# Altium schematic sheet transc_MIWI2400.SchDoc
size A; PageSetup: Record=PageOptions|CenterHorizontal=True|CenterVertical=True|PrintScale=1.00|XCorrection=1.00|YCorrection=1.00|PrintKind=1|BorderSize=5000000|LeftOffset=0|BottomOffset=0|Orientation=2|PaperLength=1000|PaperWidth=1000|Scale=100|PaperSource=7|PrintQuality=-4|MediaType=1|DitherType=10|PaperKind=A4|PrintScaleMode=1
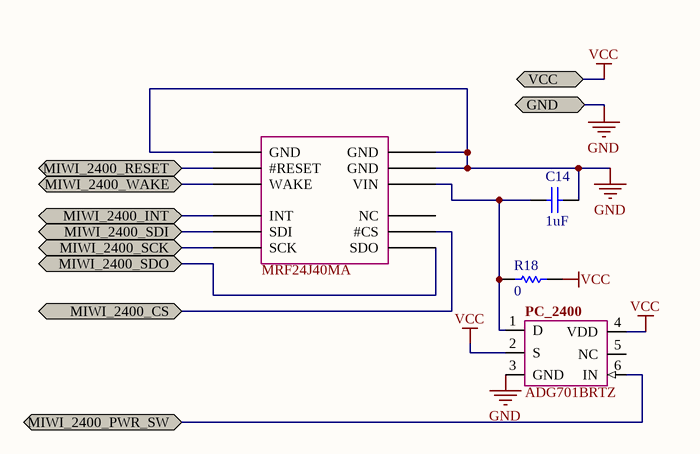
[diagram p0: transc_MIWI2400.SchDoc]

## Parts
C14  value 1uF  [1608[0603]]  (hidden comment: Cap)
MRF24J40MA  MRF24J40MA  [MRF24J40MA]  (value not drawn)
PC_2400  ADG701BRTZ  [SOT23-6_L]
R18  value 0  [1608[0603]]  (hidden comment: resistor)

## Ports
GND, MIWI_2400_CS, MIWI_2400_INT, MIWI_2400_PWR_SW, MIWI_2400_RESET, MIWI_2400_SCK, MIWI_2400_SDI, MIWI_2400_SDO, MIWI_2400_WAKE, VCC

## Nets
GND: C14.1 MRF24J40MA.1(GND) MRF24J40MA.11(GND) MRF24J40MA.12(GND) PC_2400.3(GND) ; port GND
VCC: PC_2400.2(S) PC_2400.4(VDD) R18.1 ; port VCC
MIWI_2400_CS: MRF24J40MA.8(#CS) ; port MIWI_2400_CS
MIWI_2400_INT: MRF24J40MA.4(INT) ; port MIWI_2400_INT
MIWI_2400_PWR_SW: PC_2400.6(IN) ; port MIWI_2400_PWR_SW
MIWI_2400_RESET: MRF24J40MA.2(#RESET) ; port MIWI_2400_RESET
MIWI_2400_SCK: MRF24J40MA.6(SCK) ; port MIWI_2400_SCK
MIWI_2400_SDI: MRF24J40MA.5(SDI) ; port MIWI_2400_SDI
MIWI_2400_SDO: MRF24J40MA.7(SDO) ; port MIWI_2400_SDO
MIWI_2400_WAKE: MRF24J40MA.3(WAKE) ; port MIWI_2400_WAKE
NetC14_2: C14.2 MRF24J40MA.10(VIN) PC_2400.1(D) R18.2

Not connected (* = marked no-connect by the designer): MRF24J40MA 9(NC); PC_2400 5(NC)

## Library data of the parts
C14 = Cap: Capacitor; Published: 8-Jun-2000; LatestRevisionDate: 17-Jul-2002; LatestRevisionNote: Re-released for DXP Platform.; PackageReference: RAD-0.3; Publisher: Altium Limited; PackageDescription: Radial Cap, Thru-Hole; 2 Leads; 0.3 in Pin Spacing
MRF24J40MA = MRF24J40MA: Microchip RF radio; buy: farnell:1630202
R18 = RES: Published: 8-Jun-2000; LatestRevisionDate: 17-Jul-2002; LatestRevisionNote: Re-released for DXP Platform.; PackageReference: AXIAL-0.3; Publisher: Altium Limited; PackageDescription: Axial Device, Thru-Hole; 2 Leads; 0.3 in Pin Spacing